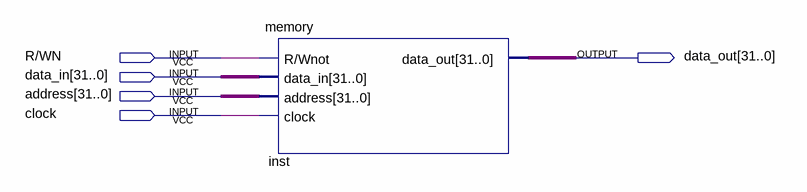
[diagram p0: schematic sheet]
// Quartus schematic CPU_RISC_ComputerArchitectureSharif.bdf as structural Verilog: 1 symbols, 5 pins
module CPU_RISC_ComputerArchitectureSharif (
  input  \R/WN ,
  input  [31:0] data_in,
  input  [31:0] address,
  input  clock,
  output [31:0] data_out
);

  memory inst (.\R/Wnot (\R/WN ), .data_in(data_in), .address(address), .clock(clock), .data_out(data_out));
endmodule
